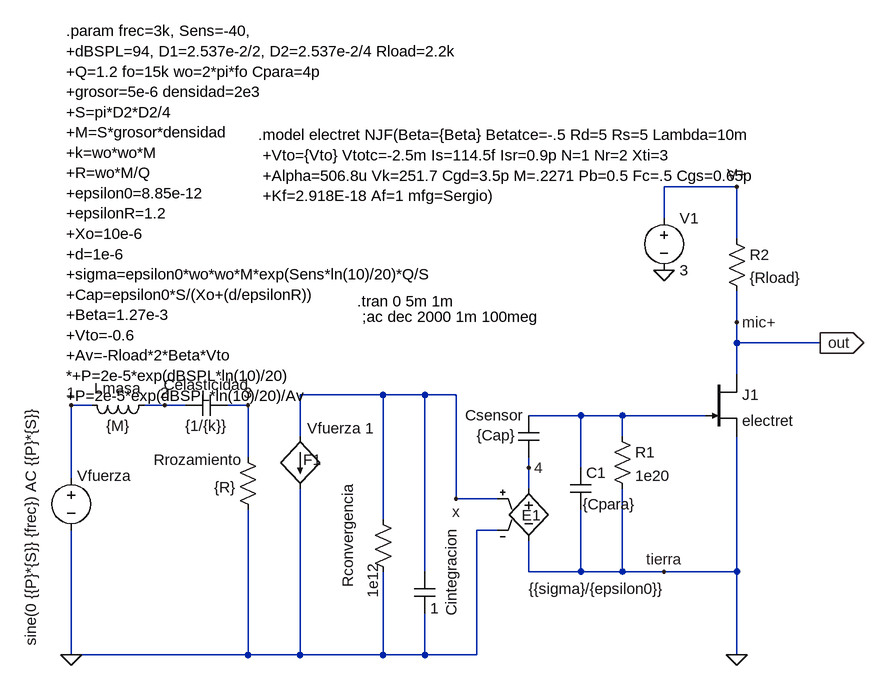
[diagram p0: schematic micelectret.asc]
micelectret.asc, the LTspice schematic file:
Version 4
SHEET 1 1544 1248
WIRE -80 64 -192 64
WIRE -192 112 -192 64
WIRE -80 144 -80 64
WIRE -80 272 -80 224
WIRE -80 304 -80 272
WIRE 48 304 -80 304
WIRE -80 352 -80 304
WIRE -624 384 -752 384
WIRE -560 384 -624 384
WIRE -512 384 -560 384
WIRE -1072 400 -1104 400
WIRE -960 400 -992 400
WIRE -928 400 -960 400
WIRE -832 400 -864 400
WIRE -320 416 -400 416
WIRE -256 416 -320 416
WIRE -128 416 -256 416
WIRE -752 448 -752 384
WIRE -256 448 -256 416
WIRE -832 480 -832 400
WIRE -400 496 -400 480
WIRE -320 496 -320 416
WIRE -1104 512 -1104 400
WIRE -400 528 -400 496
WIRE -512 544 -512 384
WIRE -448 544 -512 544
WIRE -624 576 -624 384
WIRE -448 592 -480 592
WIRE -560 656 -560 384
WIRE -400 656 -400 608
WIRE -320 656 -320 560
WIRE -320 656 -400 656
WIRE -256 656 -256 528
WIRE -256 656 -320 656
WIRE -192 656 -256 656
WIRE -80 656 -80 448
WIRE -80 656 -192 656
WIRE -1104 784 -1104 592
WIRE -832 784 -832 560
WIRE -832 784 -1104 784
WIRE -752 784 -752 528
WIRE -752 784 -832 784
WIRE -624 784 -624 656
WIRE -624 784 -752 784
WIRE -560 784 -560 720
WIRE -560 784 -624 784
WIRE -480 784 -480 592
WIRE -480 784 -560 784
WIRE -80 784 -80 656
FLAG -1104 784 0
FLAG -192 656 tierra
FLAG -400 496 4
FLAG -512 544 x
FLAG -1104 400 1
FLAG -960 400 2
FLAG -832 400 3
FLAG -80 272 mic+
FLAG -192 192 0
FLAG -80 784 0
FLAG -80 64 V+
FLAG 48 304 out
IOPIN 48 304 Out
SYMBOL voltage -1104 496 R0
WINDOW 123 24 132 Left 0
WINDOW 39 0 0 Left 0
WINDOW 0 9 12 Left 0
WINDOW 3 -62 -97 VRight 0
SYMATTR InstName Vfuerza
SYMATTR Value sine(0 {{P}*{S}} {frec}) AC {{P}*{S}}
SYMBOL cap -416 416 R0
WINDOW 0 -82 -1 Left 0
WINDOW 3 -64 30 Left 0
SYMATTR InstName Csensor
SYMATTR Value {Cap}
SYMBOL e -400 512 R0
WINDOW 0 -11 57 Left 0
WINDOW 3 0 170 Left 0
SYMATTR InstName E1
SYMATTR Value {{sigma}/{epsilon0}}
SYMBOL ind -976 384 R90
WINDOW 0 5 56 VBottom 0
WINDOW 3 32 56 VTop 0
SYMATTR InstName Lmasa
SYMATTR Value {M}
SYMBOL cap -864 384 R90
WINDOW 0 0 32 VBottom 0
WINDOW 3 32 32 VTop 0
SYMATTR InstName Celasticidad
SYMATTR Value {1/{k}}
SYMBOL res -848 464 R0
WINDOW 0 -129 20 Left 0
WINDOW 3 -36 62 Left 0
SYMATTR InstName Rrozamiento
SYMATTR Value {R}
SYMBOL f -752 448 R0
WINDOW 0 5 36 Left 0
WINDOW 3 11 -13 Left 0
SYMATTR InstName F1
SYMATTR Value Vfuerza 1
SYMBOL cap -576 656 R0
WINDOW 0 57 68 VLeft 0
SYMATTR InstName Cintegracion
SYMATTR Value 1
SYMBOL res -640 560 R0
WINDOW 0 -38 120 VLeft 0
WINDOW 3 0 136 VLeft 0
SYMATTR InstName Rconvergencia
SYMATTR Value 1e12
SYMBOL res -272 432 R0
SYMATTR InstName R1
SYMATTR Value 1e20
SYMBOL cap -336 496 R0
WINDOW 3 19 56 Left 0
SYMATTR Value {Cpara}
SYMATTR InstName C1
SYMBOL njf -128 352 R0
SYMATTR InstName J1
SYMATTR Value electret
SYMBOL res -96 128 R0
SYMATTR InstName R2
SYMATTR Value {Rload}
SYMBOL voltage -192 96 R0
WINDOW 123 24 124 Left 0
WINDOW 39 0 0 Left 0
SYMATTR InstName V1
SYMATTR Value 3
TEXT -1112 -176 Left 0 !.param frec=3k, Sens=-40,\n+dBSPL=94, D1=2.537e-2/2, D2=2.537e-2/4 Rload=2.2k\n+Q=1.2 fo=15k wo=2*pi*fo Cpara=4p\n+grosor=5e-6 densidad=2e3\n+S=pi*D2*D2/4\n+M=S*grosor*densidad\n+k=wo*wo*M\n+R=wo*M/Q\n+epsilon0=8.85e-12\n+epsilonR=1.2\n+Xo=10e-6\n+d=1e-6\n+sigma=epsilon0*wo*wo*M*exp(Sens*ln(10)/20)*Q/S\n+Cap=epsilon0*S/(Xo+(d/epsilonR))\n+Beta=1.27e-3\n+Vto=-0.6\n+Av=-Rload*2*Beta*Vto\n*+P=2e-5*exp(dBSPL*ln(10)/20)\n+P=2e-5*exp(dBSPL*ln(10)/20)/Av
TEXT -656 264 Left 0 !;ac dec 2000 1m 100meg
TEXT -816 -16 Left 0 !.model electret NJF(Beta={Beta} Betatce=-.5 Rd=5 Rs=5 Lambda=10m\n +Vto={Vto} Vtotc=-2.5m Is=114.5f Isr=0.9p N=1 Nr=2 Xti=3\n +Alpha=506.8u Vk=251.7 Cgd=3.5p M=.2271 Pb=0.5 Fc=.5 Cgs=0.65p\n +Kf=2.918E-18 Af=1 mfg=Sergio)
TEXT -664 240 Left 0 !.tran 0 5m 1m

The netlist it stands for:
* micelectret.asc
Vfuerza 1 0 sine(0 {{P}*{S}} {frec}) AC {{P}*{S}}
Csensor N001 4 {Cap}
E1 4 0 x 0 {{sigma}/{epsilon0}}
Lmasa 2 1 {M}
Celasticidad 3 2 {1/{k}}
Rrozamiento 3 0 {R}
F1 x 0 Vfuerza 1
Cintegracion x 0 1
Rconvergencia x 0 1e12
R1 N001 0 1e20
C1 N001 0 {Cpara}
J1 out N001 0 electret
R2 V+ out {Rload}
V1 V+ 0 3
.model NJF NJF
.model PJF PJF
.lib standard.jft
.param frec=3k, Sens=-40,
+dBSPL=94, D1=2.537e-2/2, D2=2.537e-2/4 Rload=2.2k
+Q=1.2 fo=15k wo=2*pi*fo Cpara=4p
+grosor=5e-6 densidad=2e3
+S=pi*D2*D2/4
+M=S*grosor*densidad
+k=wo*wo*M
+R=wo*M/Q
+epsilon0=8.85e-12
+epsilonR=1.2
+Xo=10e-6
+d=1e-6
+sigma=epsilon0*wo*wo*M*exp(Sens*ln(10)/20)*Q/S
+Cap=epsilon0*S/(Xo+(d/epsilonR))
+Beta=1.27e-3
+Vto=-0.6
+Av=-Rload*2*Beta*Vto
*+P=2e-5*exp(dBSPL*ln(10)/20)
+P=2e-5*exp(dBSPL*ln(10)/20)/Av
;ac dec 2000 1m 100meg
.model electret NJF(Beta={Beta} Betatce=-.5 Rd=5 Rs=5 Lambda=10m
 +Vto={Vto} Vtotc=-2.5m Is=114.5f Isr=0.9p N=1 Nr=2 Xti=3
 +Alpha=506.8u Vk=251.7 Cgd=3.5p M=.2271 Pb=0.5 Fc=.5 Cgs=0.65p
 +Kf=2.918E-18 Af=1 mfg=Sergio)
.tran 0 5m 1m
.backanno
.end